# EAGLE design LWOC PCB 2v1 (EAGLE 9.6.2)

## Sheet 1 of 4: POWER + HARDWARE
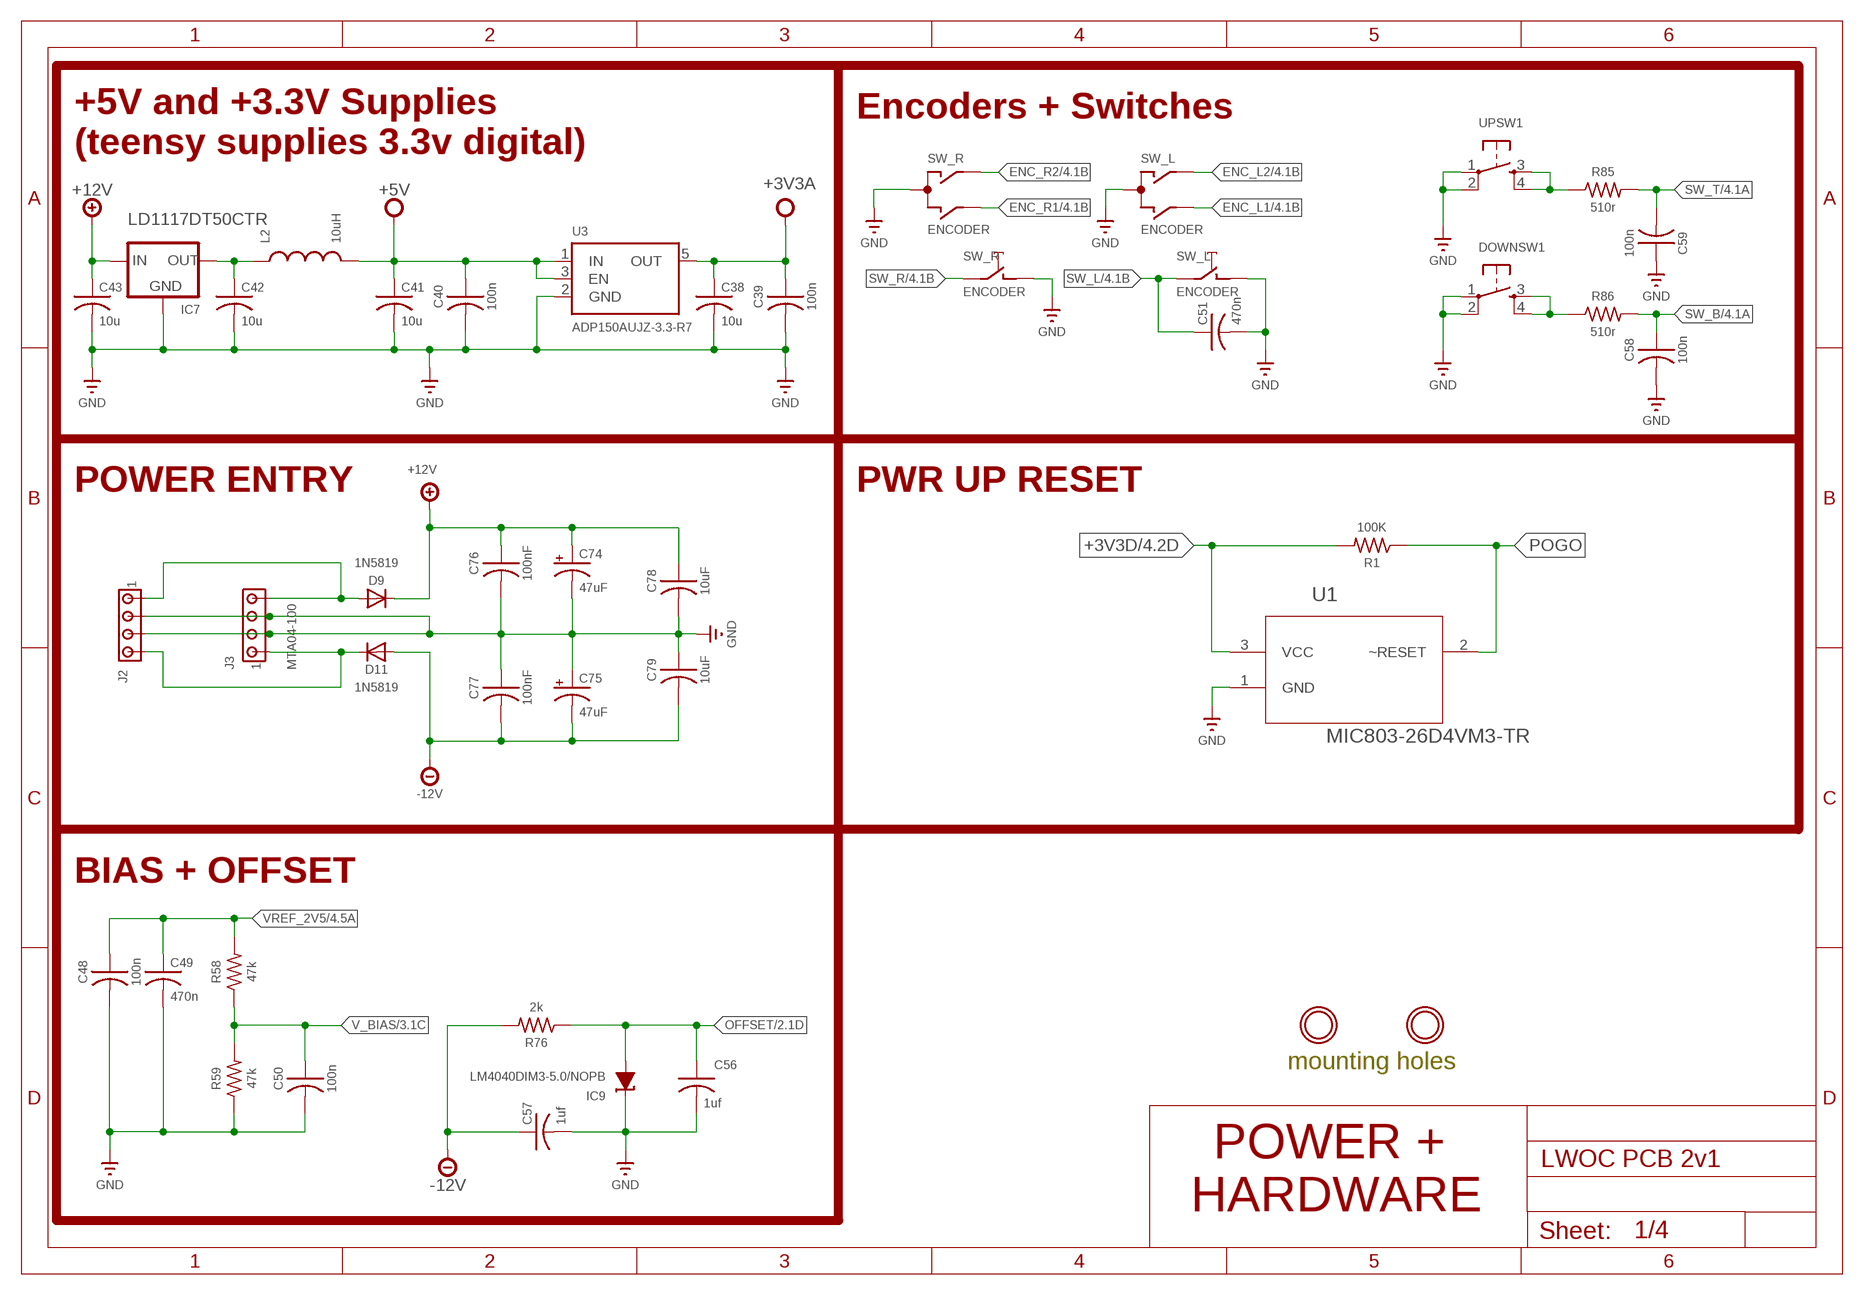
[diagram p0: schematic, sheet 1]

### Parts
C38  10u  C-USC1206K  [C1206K]
C39  100n  RCL_C-USC0603K  [RCL_C0603K]
C40  100n  RCL_C-USC0603K  [RCL_C0603K]
C41  10u  C-USC1206K  [C1206K]
C42  10u  C-USC1206K  [C1206K]
C43  10u  C-USC1206K  [C1206K]
C48  100n  RCL_C-USC0603K  [RCL_C0603K]
C49  470n  RCL_C-USC0603K  [RCL_C0603K]
C50  100n  RCL_C-USC0603K  [RCL_C0603K]
C51  470n  C-USC0805K  [C0805K]
C56  1uf  C-USC0805K  [C0805K]
C57  1uf  C-USC0805K  [C0805K]
C58  100n  RCL_C-USC0603K  [RCL_C0603K]
C59  100n  RCL_C-USC0603K  [RCL_C0603K]
C74  47uF  RCL_CPOL-USE2.5-6  [RCL_E2,5-6]
C75  47uF  RCL_CPOL-USE2.5-6  [RCL_E2,5-6]
C76  100nF  RCL_C-USC0603K  [RCL_C0603K]
C77  100nF  RCL_C-USC0603K  [RCL_C0603K]
C78  10uF  RCL_C-USC1210  [RCL_C1210]
C79  10uF  RCL_C-USC1210  [RCL_C1210]
D9  1N5819  DIODE_DIODE-SOD323-W  [DIODE_SOD323-W]
D11  1N5819  DIODE_DIODE-SOD323-W  [DIODE_SOD323-W]
DOWNSW1  SPARKFUN_TAC_SWITCHPTH  [SPARKFUN_TACTILE-PTH]
IC7  LD1117DT50CTR  LM1117TO252  [TO252]
IC9  LM4040DIM3-5.0/NOPB  LM4041A12DBZ  [DBZ_R-PDSO-G3]
J2  MTA04-156  [1X4MTA]
J3  MTA04-100  [1X04MTA]
L2  10uH  INDUCTOR1210  [1210]
R1  100K  RCL_R-US_R0603  [RCL_R0603]
R58  47k  RCL_R-US_R0603  [RCL_R0603]
R59  47k  RCL_R-US_R0603  [RCL_R0603]
R76  2k  RCL_R-US_R0603  [RCL_R0603]
R85  510r  RCL_R-US_R0603  [RCL_R0603]
R86  510r  RCL_R-US_R0603  [RCL_R0603]
SW_L  ENCODER  OG-ENCODER_EC12E_SW  [OG-ENCODER_ALPS_EC12E_SW]
SW_R  ENCODER  OG-ENCODER_EC12E_SW  [OG-ENCODER_ALPS_EC12E_SW]
U1  MIC803-26D4VM3-TR  MIC803-30D4VM3TR  [SOT95P232X110-3N]
U3  ADP150AUJZ-3.3-R7  ADP121  [SOT23-5]
U$23  MOUNTINGHOLE2.5  [MOUNTINGHOLE_2.5_PLATED]
U$26  MOUNTINGHOLE2.5  [MOUNTINGHOLE_2.5_PLATED]
UPSW1  SPARKFUN_TAC_SWITCHPTH  [SPARKFUN_TACTILE-PTH]

### Nets
+3V3A: C38.1 C39.1 U3.5(OUT) ; also sheet 2,4
+3V3D: R1.2 U1.3(VCC) ; also sheet 4
+5V: C40.1 C41.1 L2.2 U3.1(IN) U3.3(EN) ; also sheet 4
+12V: C43.1 C74.+ C76.1 C78.1 D9.C IC7.2(IN) ; also sheet 3
-12V: C57.1 C75.- C77.2 C79.2 D11.A R76.2 ; also sheet 3
ENC_L1: SW_L.B ; also sheet 4
ENC_L2: SW_L.A ; also sheet 4
ENC_R1: SW_R.B ; also sheet 4
ENC_R2: SW_R.A ; also sheet 4
GND: C38.2 C39.2 C40.2 C41.2 C42.2 C43.2 C48.2 C49.2 C50.2 C51.2 C56.2 C57.2 C58.2 C59.1 C74.- C75.+ C76.2 C77.1 C78.2 C79.1 DOWNSW1.1 DOWNSW1.2 IC7.1(GND) IC9.1(C) J2.2 J2.3 J3.2 J3.3 R59.1 SW_L.C SW_L.D SW_R.C SW_R.D U1.1(GND) U3.2(GND) UPSW1.1 UPSW1.2 ; also sheet 2,3,4
N$33: C42.1 IC7.3(OUT) L2.1
N$40: R85.1 UPSW1.3 UPSW1.4
N$41: DOWNSW1.3 DOWNSW1.4 R86.1
N$196: D11.C J2.4 J3.4
N$263: D9.A J2.1 J3.1
OFFSET: C56.1 IC9.2(A) R76.1 ; also sheet 2
POGO: R1.1 U1.2(~RESET)
SW_B: C58.1 R86.2 ; also sheet 4
SW_L: C51.1 SW_L.E ; also sheet 4
SW_R: SW_R.E ; also sheet 4
SW_T: C59.2 R85.2 ; also sheet 4
V_BIAS: C50.1 R58.1 R59.2 ; also sheet 3
VREF_2V5: C48.1 C49.1 R58.2 ; also sheet 4
Unconnected: SW_L.GND1(G) SW_L.GND2(G) SW_R.GND1(G) SW_R.GND2(G)

### Notes on the sheet
- Encoders + Switches
- +5V and +3.3V Supplies
  (teensy supplies 3.3v digital)
- POWER ENTRY | PWR UP RESET
- BIAS + OFFSET
- mounting holes
- POWER + 
  HARDWARE

## Sheet 2 of 4: INPUT STAGES
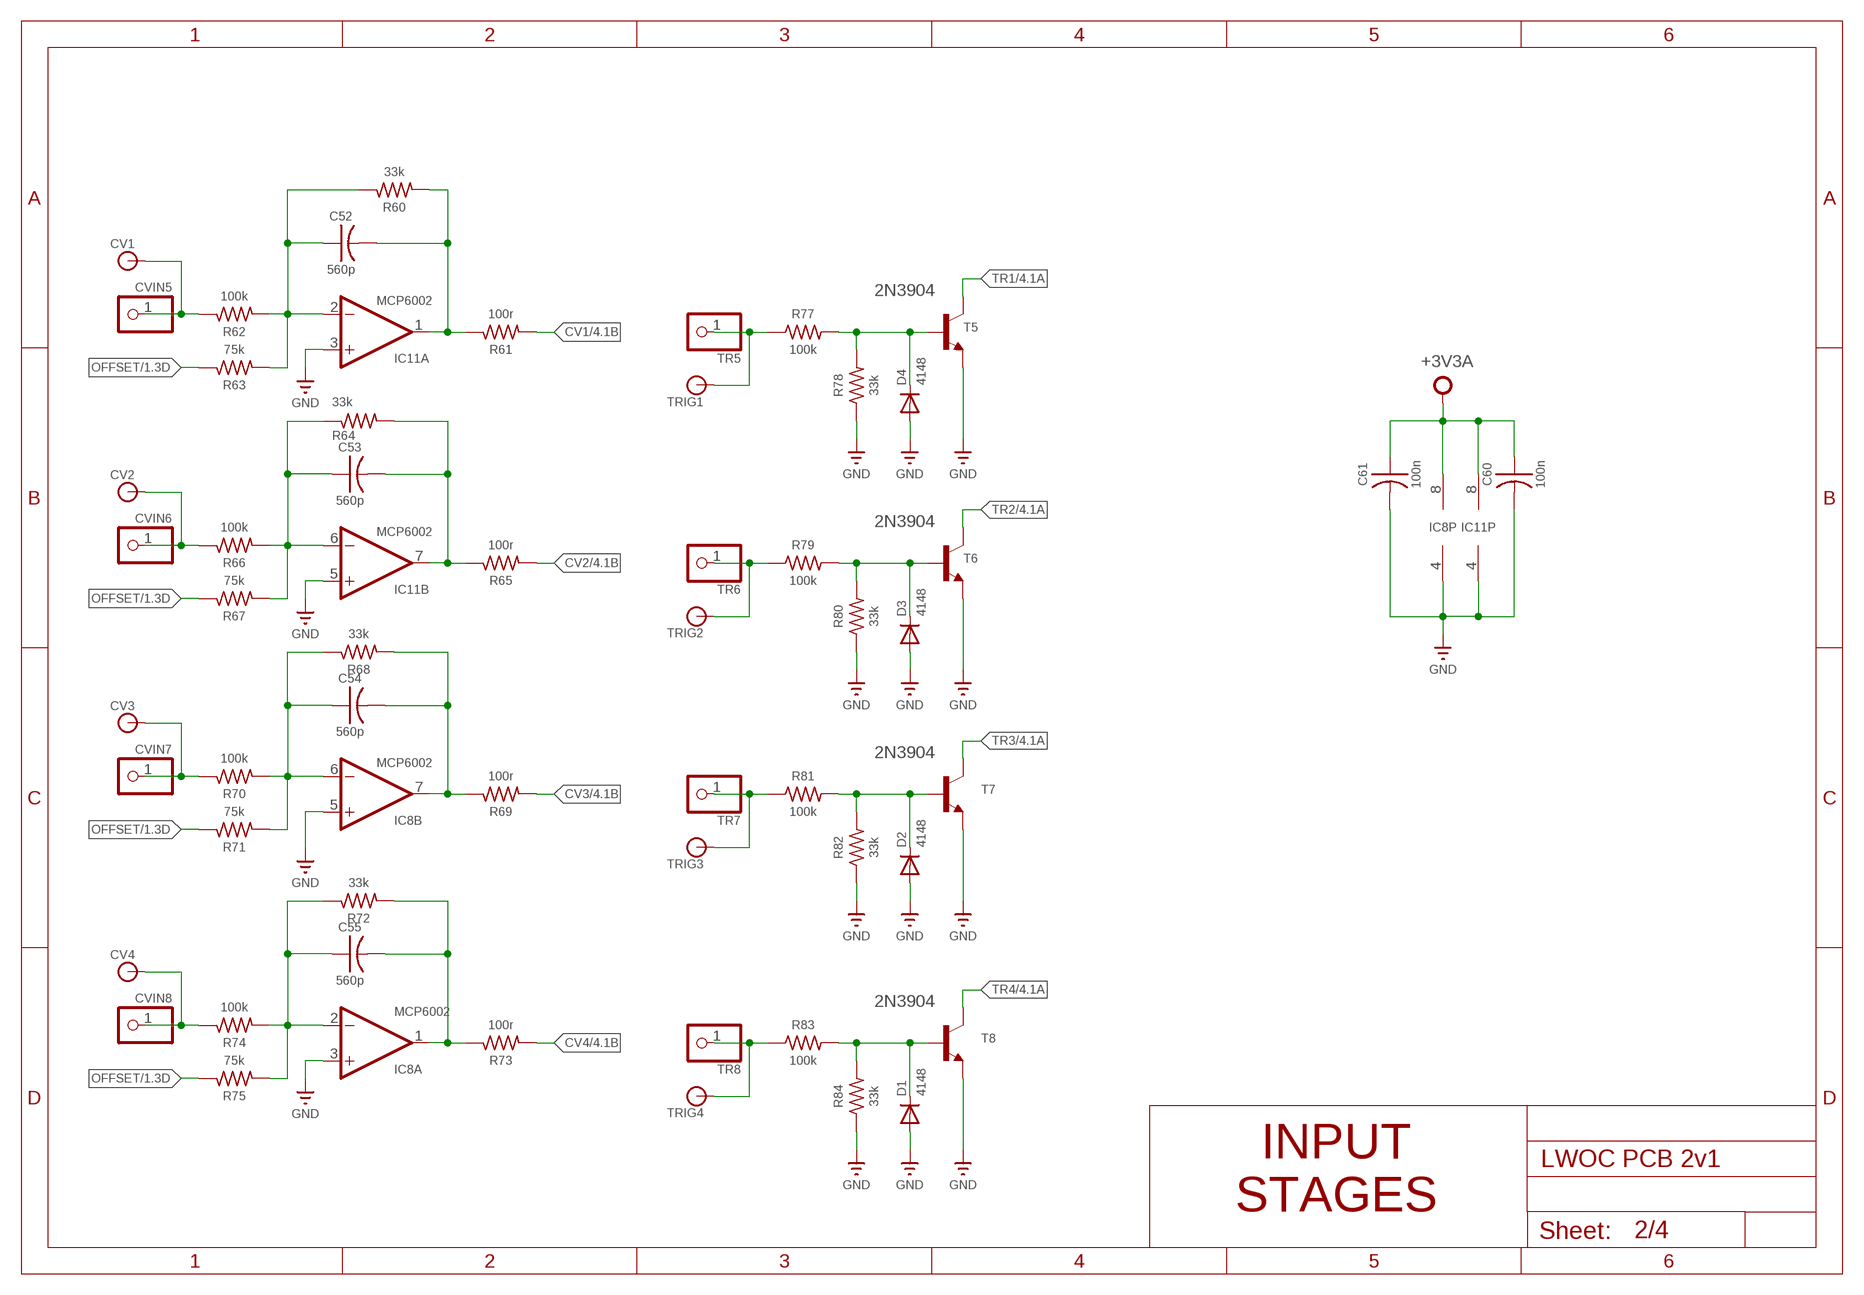
[diagram p1: schematic, sheet 2]

### Parts
C52  560p  RCL_C-USC0603K  [RCL_C0603K]
C53  560p  RCL_C-USC0603K  [RCL_C0603K]
C54  560p  RCL_C-USC0603K  [RCL_C0603K]
C55  560p  RCL_C-USC0603K  [RCL_C0603K]
C60  100n  RCL_C-USC0603K  [RCL_C0603K]
C61  100n  RCL_C-USC0603K  [RCL_C0603K]
CV1  BANANA_CONN  [BANANA_CONN]
CV2  BANANA_CONN  [BANANA_CONN]
CV3  BANANA_CONN  [BANANA_CONN]
CV4  BANANA_CONN  [BANANA_CONN]
CVIN5  PINHD-1X1  [1X01]
CVIN6  PINHD-1X1  [1X01]
CVIN7  PINHD-1X1  [1X01]
CVIN8  PINHD-1X1  [1X01]
D1  4148  DIODE_DIODE-SOD323-W  [DIODE_SOD323-W]
D2  4148  DIODE_DIODE-SOD323-W  [DIODE_SOD323-W]
D3  4148  DIODE_DIODE-SOD323-W  [DIODE_SOD323-W]
D4  4148  DIODE_DIODE-SOD323-W  [DIODE_SOD323-W]
IC8  MCP6002  GM-ICS_TL072D  [GM-ICS_SO08]
IC11  MCP6002  GM-ICS_TL072D  [GM-ICS_SO08]
R60  33k  RCL_R-US_R0603  [RCL_R0603]
R61  100r  RCL_R-US_R0603  [RCL_R0603]
R62  100k  RCL_R-US_R0603  [RCL_R0603]
R63  75k  RCL_R-US_R0603  [RCL_R0603]
R64  33k  RCL_R-US_R0603  [RCL_R0603]
R65  100r  RCL_R-US_R0603  [RCL_R0603]
R66  100k  RCL_R-US_R0603  [RCL_R0603]
R67  75k  RCL_R-US_R0603  [RCL_R0603]
R68  33k  RCL_R-US_R0603  [RCL_R0603]
R69  100r  RCL_R-US_R0603  [RCL_R0603]
R70  100k  RCL_R-US_R0603  [RCL_R0603]
R71  75k  RCL_R-US_R0603  [RCL_R0603]
R72  33k  RCL_R-US_R0603  [RCL_R0603]
R73  100r  RCL_R-US_R0603  [RCL_R0603]
R74  100k  RCL_R-US_R0603  [RCL_R0603]
R75  75k  RCL_R-US_R0603  [RCL_R0603]
R77  100k  RCL_R-US_R0603  [RCL_R0603]
R78  33k  RCL_R-US_R0603  [RCL_R0603]
R79  100k  RCL_R-US_R0603  [RCL_R0603]
R80  33k  RCL_R-US_R0603  [RCL_R0603]
R81  100k  RCL_R-US_R0603  [RCL_R0603]
R82  33k  RCL_R-US_R0603  [RCL_R0603]
R83  100k  RCL_R-US_R0603  [RCL_R0603]
R84  33k  RCL_R-US_R0603  [RCL_R0603]
T5  2N3904  TRANSISTOR_MMBT3904LT1-NPN-SOT23-BEC  [TRANSISTOR_SOT23-BEC]
T6  2N3904  TRANSISTOR_MMBT3904LT1-NPN-SOT23-BEC  [TRANSISTOR_SOT23-BEC]
T7  2N3904  TRANSISTOR_MMBT3904LT1-NPN-SOT23-BEC  [TRANSISTOR_SOT23-BEC]
T8  2N3904  TRANSISTOR_MMBT3904LT1-NPN-SOT23-BEC  [TRANSISTOR_SOT23-BEC]
TR5  PINHD-1X1  [1X01]
TR6  PINHD-1X1  [1X01]
TR7  PINHD-1X1  [1X01]
TR8  PINHD-1X1  [1X01]
TRIG1  BANANA_CONN  [BANANA_CONN]
TRIG2  BANANA_CONN  [BANANA_CONN]
TRIG3  BANANA_CONN  [BANANA_CONN]
TRIG4  BANANA_CONN  [BANANA_CONN]

### Nets
+3V3A: C60.1 C61.1 IC8.8(P:V+) IC11.8(P:V+) ; also sheet 1,4
CV1: R61.2 ; also sheet 4
CV2: R65.2 ; also sheet 4
CV3: R69.2 ; also sheet 4
CV4: R73.2 ; also sheet 4
GND: C60.2 C61.2 D1.A D2.A D3.A D4.A IC8.3(A:+IN) IC8.4(P:V-) IC8.5(B:+IN) IC11.3(A:+IN) IC11.4(P:V-) IC11.5(B:+IN) R78.1 R80.1 R82.1 R84.1 T5.E T6.E T7.E T8.E ; also sheet 1,3,4
N$42: CV1.P$1 CVIN5.1 R62.1
N$43: C52.1 IC11.2(A:-IN) R60.1 R62.2 R63.2
N$44: C52.2 IC11.1(A:OUT) R60.2 R61.1
N$45: CV2.P$1 CVIN6.1 R66.1
N$46: C53.1 IC11.6(B:-IN) R64.1 R66.2 R67.2
N$47: C53.2 IC11.7(B:OUT) R64.2 R65.1
N$48: CV3.P$1 CVIN7.1 R70.1
N$49: C54.1 IC8.6(B:-IN) R68.1 R70.2 R71.2
N$50: C54.2 IC8.7(B:OUT) R68.2 R69.1
N$51: CV4.P$1 CVIN8.1 R74.1
N$52: C55.1 IC8.2(A:-IN) R72.1 R74.2 R75.2
N$53: C55.2 IC8.1(A:OUT) R72.2 R73.1
N$54: R77.1 TR5.1 TRIG1.P$1
N$55: R79.1 TR6.1 TRIG2.P$1
N$56: R81.1 TR7.1 TRIG3.P$1
N$57: D1.C R83.2 R84.2 T8.B
N$58: D2.C R81.2 R82.2 T7.B
N$59: D3.C R79.2 R80.2 T6.B
N$60: D4.C R77.2 R78.2 T5.B
N$61: R83.1 TR8.1 TRIG4.P$1
OFFSET: R63.1 R67.1 R71.1 R75.1 ; also sheet 1
TR1: T5.C ; also sheet 4
TR2: T6.C ; also sheet 4
TR3: T7.C ; also sheet 4
TR4: T8.C ; also sheet 4

### Notes on the sheet
- INPUT
  STAGES

## Sheet 3 of 4: OUTPUT STAGES
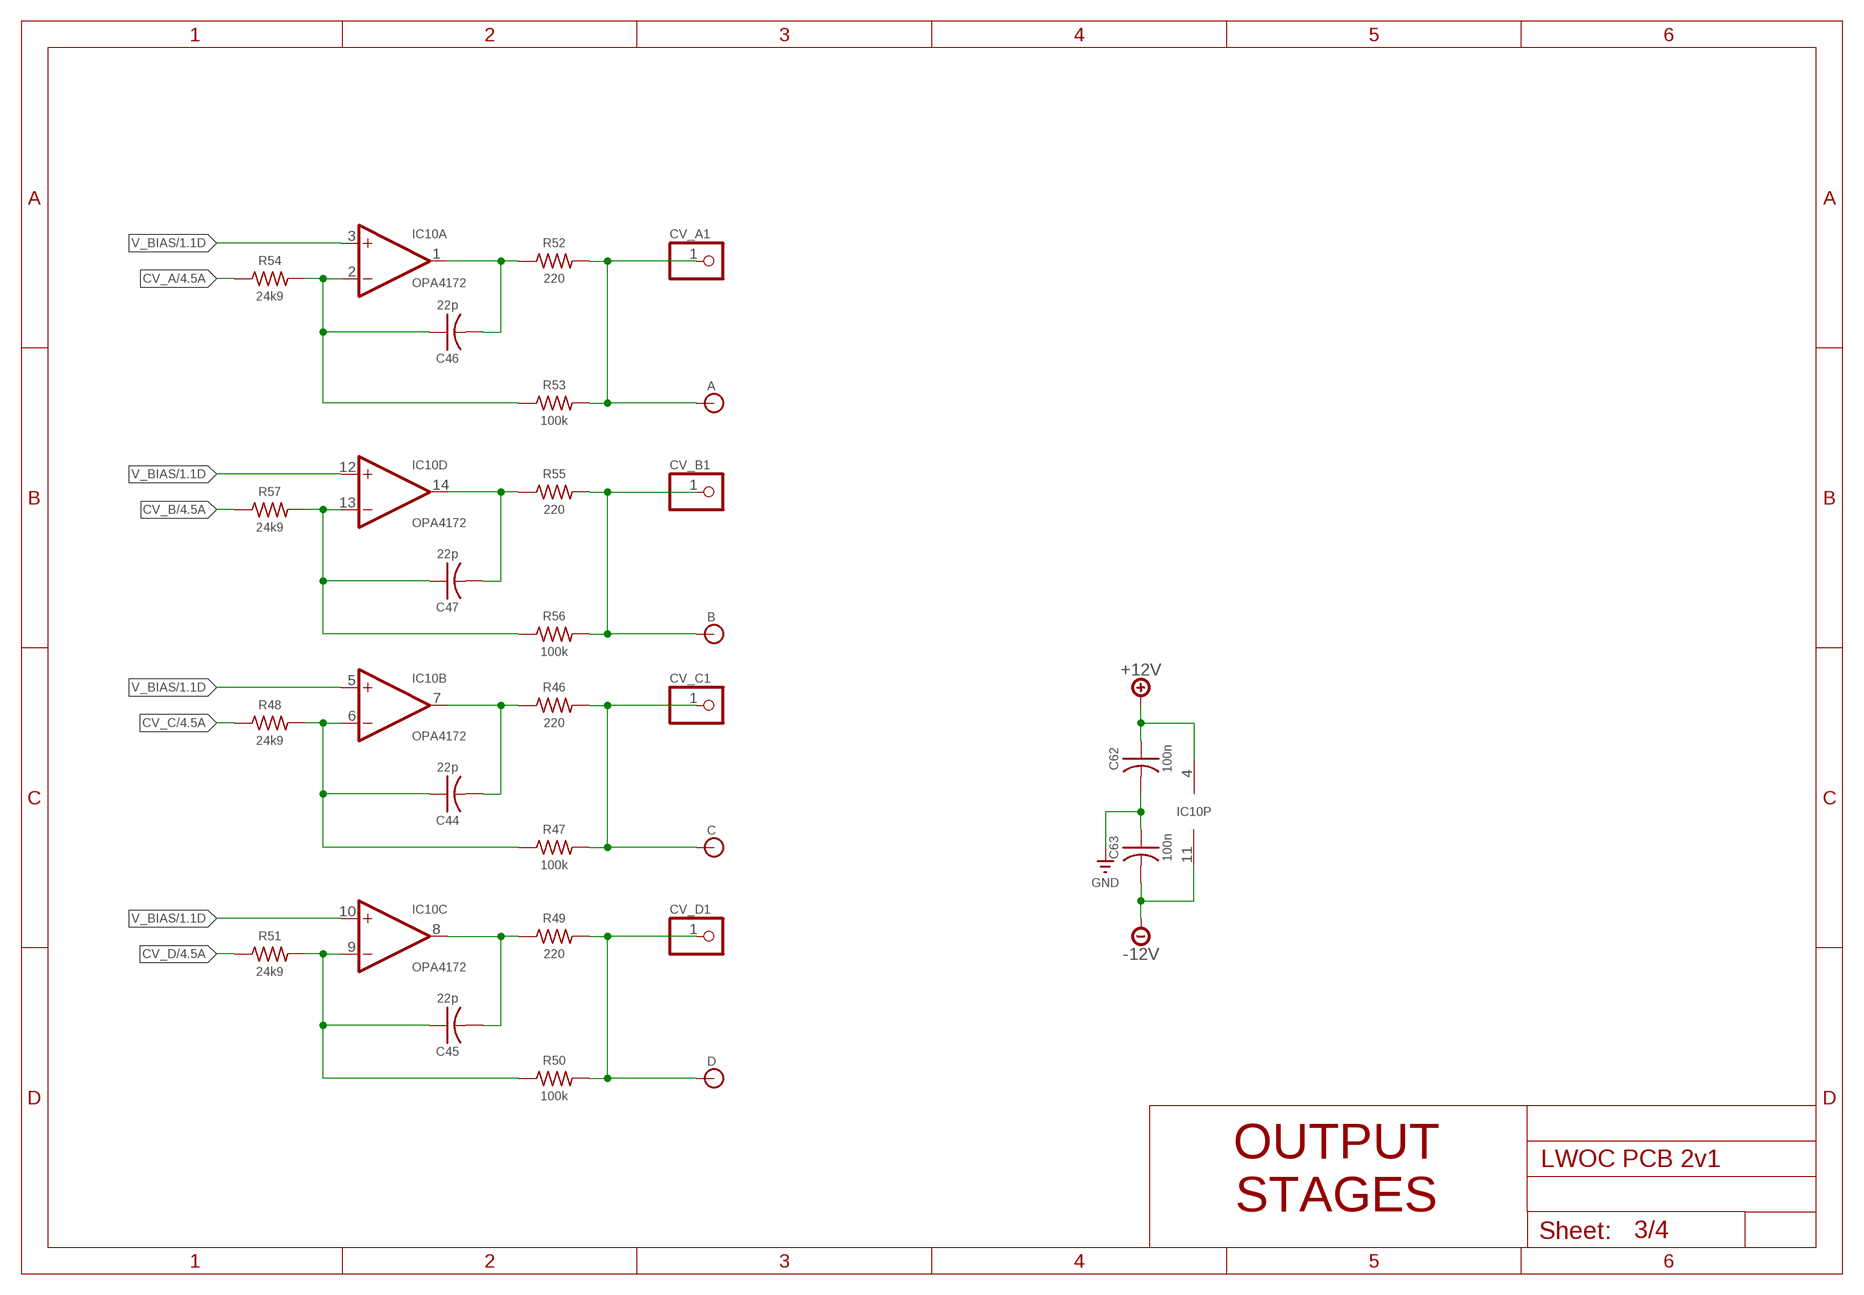
[diagram p2: schematic, sheet 3]

### Parts
A  BANANA_CONN  [BANANA_CONN]
B  BANANA_CONN  [BANANA_CONN]
C  BANANA_CONN  [BANANA_CONN]
C44  22p  RCL_C-USC0603K  [RCL_C0603K]
C45  22p  RCL_C-USC0603K  [RCL_C0603K]
C46  22p  RCL_C-USC0603K  [RCL_C0603K]
C47  22p  RCL_C-USC0603K  [RCL_C0603K]
C62  100n  RCL_C-USC0603K  [RCL_C0603K]
C63  100n  RCL_C-USC0603K  [RCL_C0603K]
CV_A1  PINHD-1X1  [1X01]
CV_B1  PINHD-1X1  [1X01]
CV_C1  PINHD-1X1  [1X01]
CV_D1  PINHD-1X1  [1X01]
D  BANANA_CONN  [BANANA_CONN]
IC10  OPA4172  GM-ICS_TL074D  [GM-ICS_SO14]
R46  220  RCL_R-US_R0603  [RCL_R0603]
R47  100k  RCL_R-US_R0603  [RCL_R0603]
R48  24k9  RCL_R-US_R0603  [RCL_R0603]
R49  220  RCL_R-US_R0603  [RCL_R0603]
R50  100k  RCL_R-US_R0603  [RCL_R0603]
R51  24k9  RCL_R-US_R0603  [RCL_R0603]
R52  220  RCL_R-US_R0603  [RCL_R0603]
R53  100k  RCL_R-US_R0603  [RCL_R0603]
R54  24k9  RCL_R-US_R0603  [RCL_R0603]
R55  220  RCL_R-US_R0603  [RCL_R0603]
R56  100k  RCL_R-US_R0603  [RCL_R0603]
R57  24k9  RCL_R-US_R0603  [RCL_R0603]

### Nets
+12V: C62.1 IC10.4(P:V+) ; also sheet 1
-12V: C63.2 IC10.11(P:V-) ; also sheet 1
CV_A: R54.1 ; also sheet 4
CV_B: R57.1 ; also sheet 4
CV_C: R48.1 ; also sheet 4
CV_D: R51.1 ; also sheet 4
GND: C62.2 C63.1 ; also sheet 1,2,4
N$62: C44.1 IC10.6(B:-IN) R47.1 R48.2
N$63: C44.2 IC10.7(B:OUT) R46.1
N$64: C45.1 IC10.9(C:-IN) R50.1 R51.2
N$65: C45.2 IC10.8(C:OUT) R49.1
N$66: C46.1 IC10.2(A:-IN) R53.1 R54.2
N$67: C46.2 IC10.1(A:OUT) R52.1
N$68: C47.1 IC10.13(D:-IN) R56.1 R57.2
N$69: C47.2 IC10.14(D:OUT) R55.1
N$70: B.P$1 CV_B1.1 R55.2 R56.2
N$71: CV_D1.1 D.P$1 R49.2 R50.2
N$72: A.P$1 CV_A1.1 R52.2 R53.2
N$73: C.P$1 CV_C1.1 R46.2 R47.2
V_BIAS: IC10.3(A:+IN) IC10.5(B:+IN) IC10.10(C:+IN) IC10.12(D:+IN) ; also sheet 1

### Notes on the sheet
- OUTPUT
  STAGES

## Sheet 4 of 4: TEENSY DAC and OLED
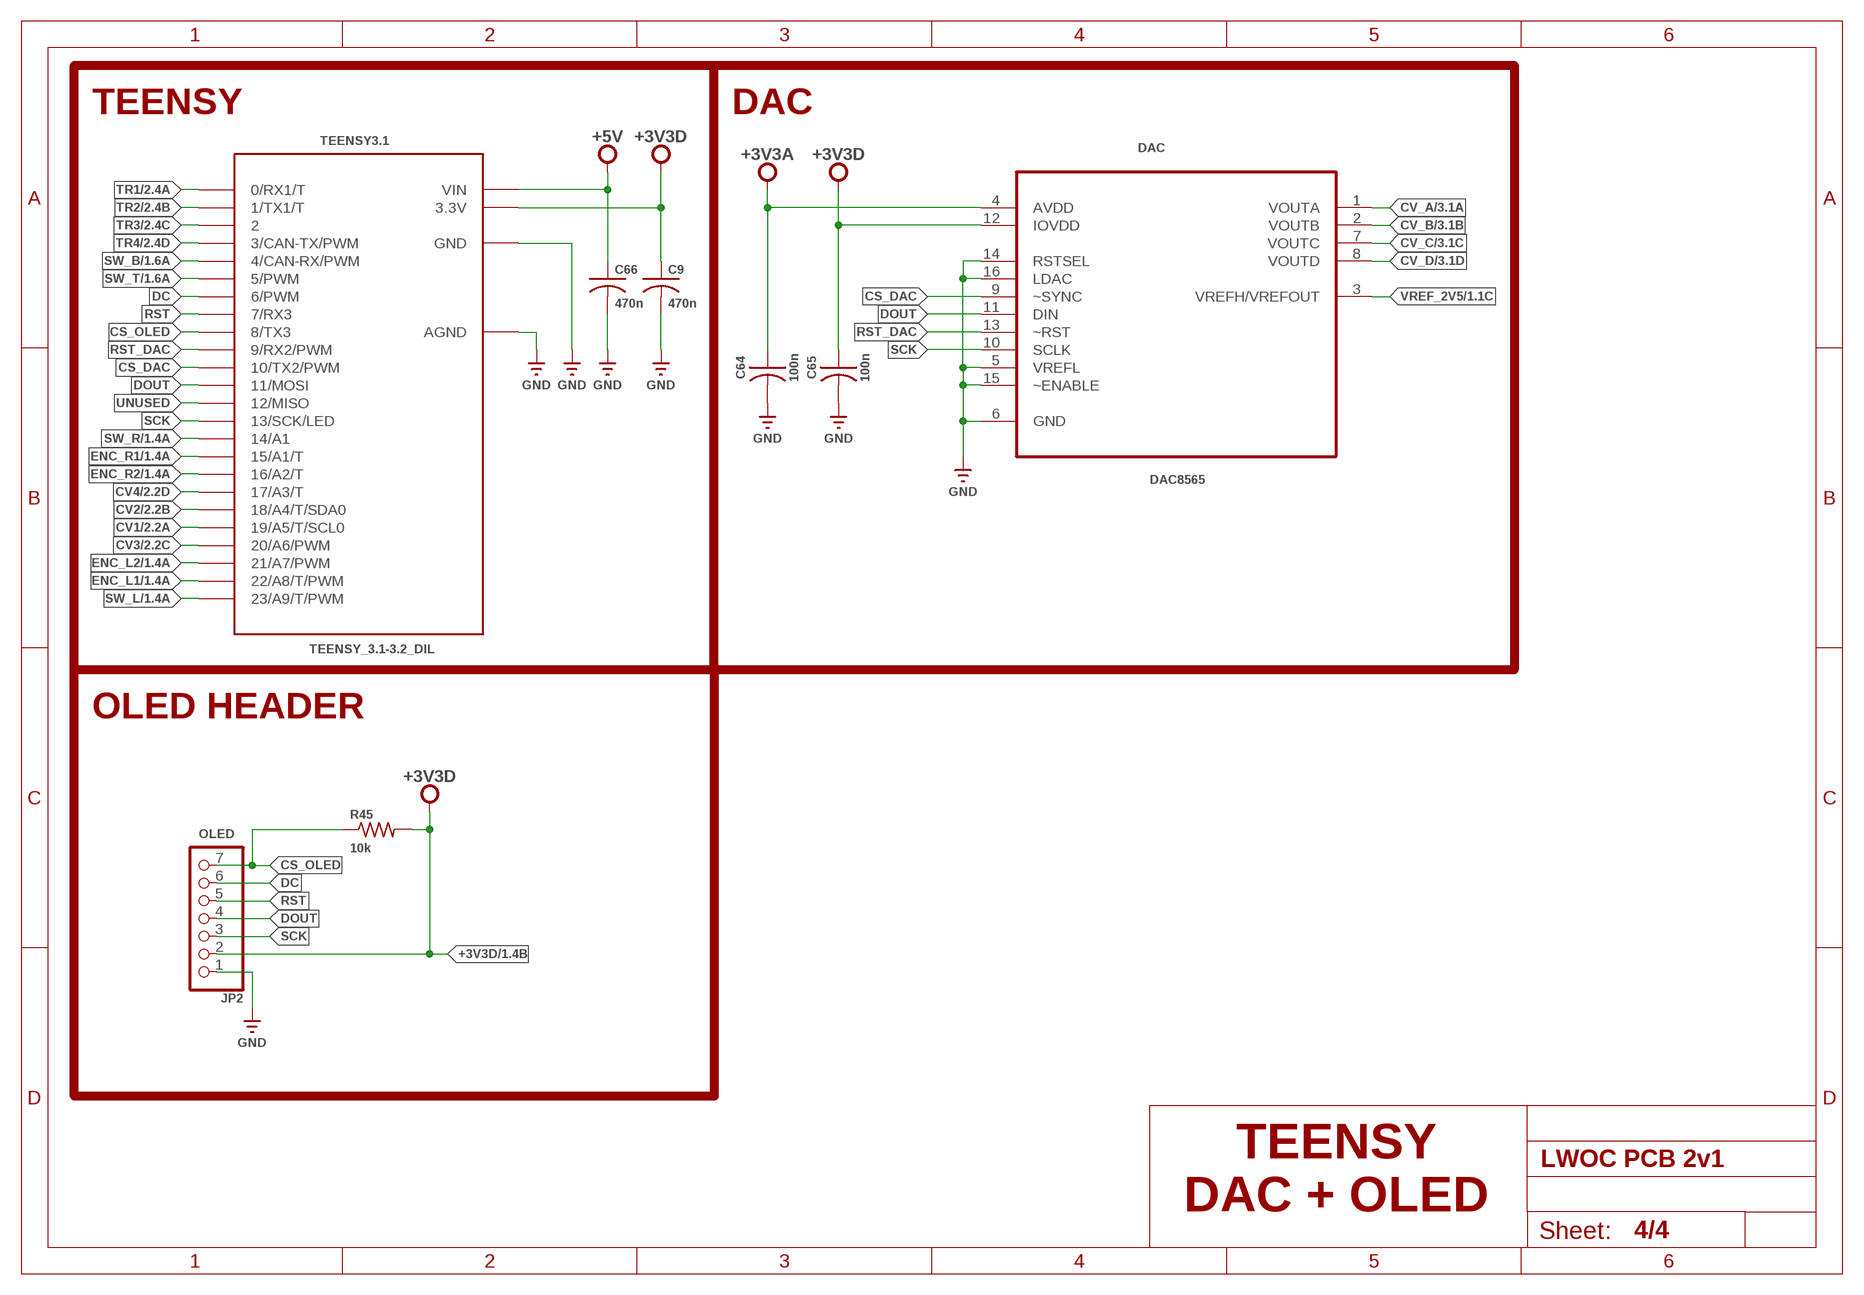
[diagram p3: schematic, sheet 4]

### Parts
C9  470n  C-USC0805K  [C0805K]
C64  100n  RCL_C-USC0603K  [RCL_C0603K]
C65  100n  RCL_C-USC0603K  [RCL_C0603K]
C66  470n  C-USC0805K  [C0805K]
DAC  DAC8565  DAC8565IAPW  [SOP65P640X120-16N]
JP2  OLED  PINHD-1X07_2.54-S  [1X07-S]
R45  10k  R-US_M0805  [M0805]
TEENSY3.1  TEENSY_3.1-3.2_DIL  [TEENSY_3.0-3.2&LC_DIL]

### Nets
+3V3A: C64.1 DAC.4(AVDD) ; also sheet 1,2
+3V3D: C9.1 C65.1 DAC.12(IOVDD) JP2.2 R45.2 TEENSY3.1.3.3V ; also sheet 1
+5V: C66.1 TEENSY3.1.VIN ; also sheet 1
CS_DAC: DAC.9(~SYNC) TEENSY3.1.10(10/TX2/PWM)
CS_OLED: JP2.7 R45.1 TEENSY3.1.8(8/TX3)
CV1: TEENSY3.1.19/A5(19/A5/T/SCL0) ; also sheet 2
CV2: TEENSY3.1.18/A4(18/A4/T/SDA0) ; also sheet 2
CV3: TEENSY3.1.20/A6(20/A6/PWM) ; also sheet 2
CV4: TEENSY3.1.17/A3(17/A3/T) ; also sheet 2
CV_A: DAC.1(VOUTA) ; also sheet 3
CV_B: DAC.2(VOUTB) ; also sheet 3
CV_C: DAC.7(VOUTC) ; also sheet 3
CV_D: DAC.8(VOUTD) ; also sheet 3
DC: JP2.6 TEENSY3.1.6(6/PWM)
DOUT: DAC.11(DIN) JP2.4 TEENSY3.1.11(11/MOSI)
ENC_L1: TEENSY3.1.22/A8(22/A8/T/PWM) ; also sheet 1
ENC_L2: TEENSY3.1.21/A7(21/A7/PWM) ; also sheet 1
ENC_R1: TEENSY3.1.15/A1(15/A1/T) ; also sheet 1
ENC_R2: TEENSY3.1.16/A2(16/A2/T) ; also sheet 1
GND: C9.2 C64.2 C65.2 C66.2 DAC.5(VREFL) DAC.6(GND) DAC.14(RSTSEL) DAC.15(~ENABLE) DAC.16(LDAC) JP2.1 TEENSY3.1.AGND TEENSY3.1.GND ; also sheet 1,2,3
RST: JP2.5 TEENSY3.1.7(7/RX3)
RST_DAC: DAC.13(~RST) TEENSY3.1.9(9/RX2/PWM)
SCK: DAC.10(SCLK) JP2.3 TEENSY3.1.13(13/SCK/LED)
SW_B: TEENSY3.1.4(4/CAN-RX/PWM) ; also sheet 1
SW_L: TEENSY3.1.23/A9(23/A9/T/PWM) ; also sheet 1
SW_R: TEENSY3.1.14/A0(14/A1) ; also sheet 1
SW_T: TEENSY3.1.5(5/PWM) ; also sheet 1
TR1: TEENSY3.1.0(0/RX1/T) ; also sheet 2
TR2: TEENSY3.1.1(1/TX1/T) ; also sheet 2
TR3: TEENSY3.1.2 ; also sheet 2
TR4: TEENSY3.1.3(3/CAN-TX/PWM) ; also sheet 2
UNUSED: TEENSY3.1.12(12/MISO)
VREF_2V5: DAC.3(VREFH/VREFOUT) ; also sheet 1

### Notes on the sheet
- TEENSY | DAC
- OLED HEADER
- TEENSY
  DAC + OLED

## Library data of the parts
A B C CV1-CV4 D TRIG1-TRIG4 = SparkFun-Connectors:BANANA_CONN: Through-hole Banana Jack Basic PTH connection for banana jack plugs SparkFun Products: Multimeter Kit <https://www.sparkfun.com/products/retired/10956> Banana to Alligator Cable <https://www.sparkfun.com/products/retired/509> Banana to Alligator Coax Cable <https://www.sparkfun.com/products/retired/508> Banana to Banana Cable <https://www.sparkfun.com/products/retired/507> Banana to IC Hook Cables <https://www.sparkfun.com/products/retired/506>
C9 C38 C41-C43 C51 C56 C57 C66 = elements_v02:C-US: CAPACITOR, American symbol
C39 C40 C44-C50 C52-C55 C58-C65 C78 C79 = clouds_v30:RCL_C-US: CAPACITOR, American symbol
C74 C75 = ripples_v40:RCL_CPOL-US: POLARIZED CAPACITOR, American symbol
C76 C77 = ripples_v40:RCL_C-US: CAPACITOR, American symbol
CV_A1 CV_B1 CV_C1 CV_D1 CVIN5-CVIN8 TR5-TR8 = pinhead:PINHD-1X1: PIN HEADER
D1-D4 = clouds_v30:DIODE_DIODE-: DIODE
D9 D11 = ripples_v40:DIODE_DIODE-: DIODE
DAC = DAC8565IAPW:DAC8565IAPW: Quad Channel DAC; AVAILABILITY: Good; DESCRIPTION: 16-Bit, Quad Channel, Ultra-Low Glitch, Voltage Output DAC with 2.5V, 2ppm/C Internal eference 16-TSSOP -40 to 105; MF: Texas Instruments; MP: DAC8565IAPW; PACKAGE: TSSOP-16 Texas Instruments; PRICE: 11.99 USD
DOWNSW1 UPSW1 = clouds_v30:SPARKFUN_TAC_SWITCH: Momentary Switch Button commonly used for reset or general input. Spark Fun Electronics SKU : COM-00097
IC7 = v-reg-2:LM1117
IC8 IC11 = clouds_v30:GM-ICS_TL072: OP AMP
IC9 = elements_v02:LM4041: PRECISION MICROPOWER SHUNT VOLTAGE REFERENCE Source: http://focus.ti.com/lit/ds/slcs146e/slcs146e.pdf
IC10 = clouds_v30:GM-ICS_TL074: OP AMP
J2 = con-amp:MTA04-156: AMP connector
J3 = AMP_MTA:MTA04-100
JP2 = pinhead-2:PINHD-1X07: PIN HEADER
L2 = Icotech_Eagle_Library:INDUCTOR: Inductors Basic Inductor/Choke - 0603 and 1206. Footprints are not proven and vary greatly between part numbers.
R1 R46-R86 = clouds_v30:RCL_R-US_: RESISTOR, American symbol
R45 = elements_v02:R-US_: RESISTOR, American symbol
SW_L SW_R = braids_v50:OG-ENCODER_EC12E_SW: ALPS rotary Encoder EC12E series with switch
T5-T8 = braids_v50:TRANSISTOR_*-NPN-: NPN Transistror BF959 corrected 2008.03.06
TEENSY3.1 = Teensy_3_and_LC_Series_Boards_v1.4:TEENSY_3.1-3.2_DIL: Teensy 3.1 or 3.2 in a DIL Layout.
U1 = Micrel_By_element14_Batch_1:MIC803-30D4VM3TR: 3 Pin Microprocessor Supervisor Circuit; MPN: MIC803-30D4VM3TR; OC_FARNELL: 1924769; OC_NEWARK: 58T4951; PACKAGE: SOT-23-3; SUPPLIER: MICREL SEMICONDUCTOR
U3 = microbuilder:ADP121: LDO Fixed Voltage Regulator 150mA The ADP121 voltage regulator is ideal for regulating battery or solar power due to it's very low foreward voltage drop (maximum 90mV at 150mA). Forward Voltage Dropout: 90mV at 150mA Input Voltage Range: 2.3V-5.5V Output Voltage Range: 1.2V-3.3V (depending on model) Digikey: 3.3V - ADP121-AUJZ33R7CT-ND Digikey: 3.0V - ADP121-AUJZ30R7CT-ND
U$23 U$26 = microbuilder:MOUNTINGHOLE: Mounting Hole For #2 screws (0.086"/2.18mm width, 0.094"/2.4mm hole) use 2.5mm

## Board
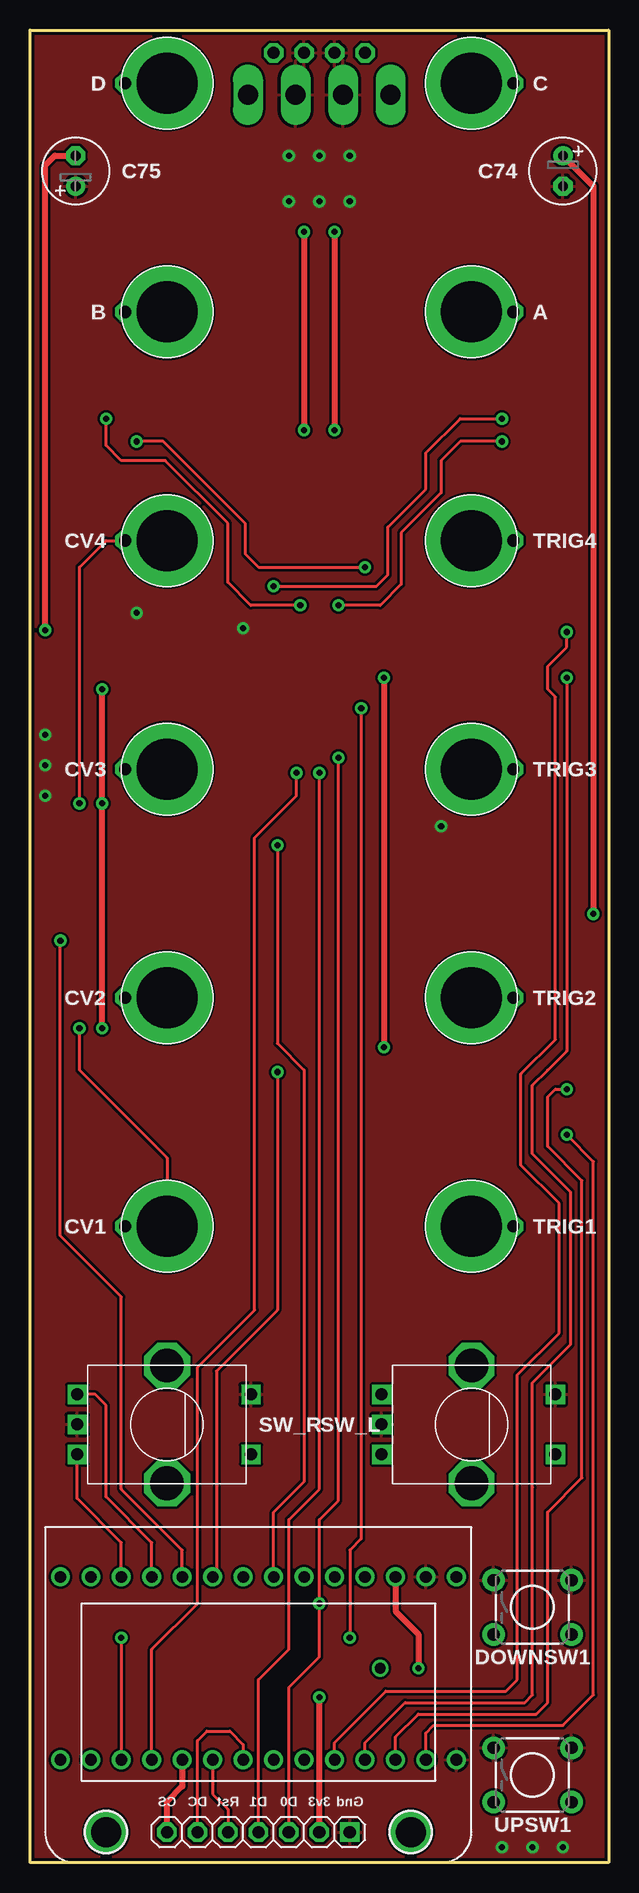
[diagram p4: board, top side]
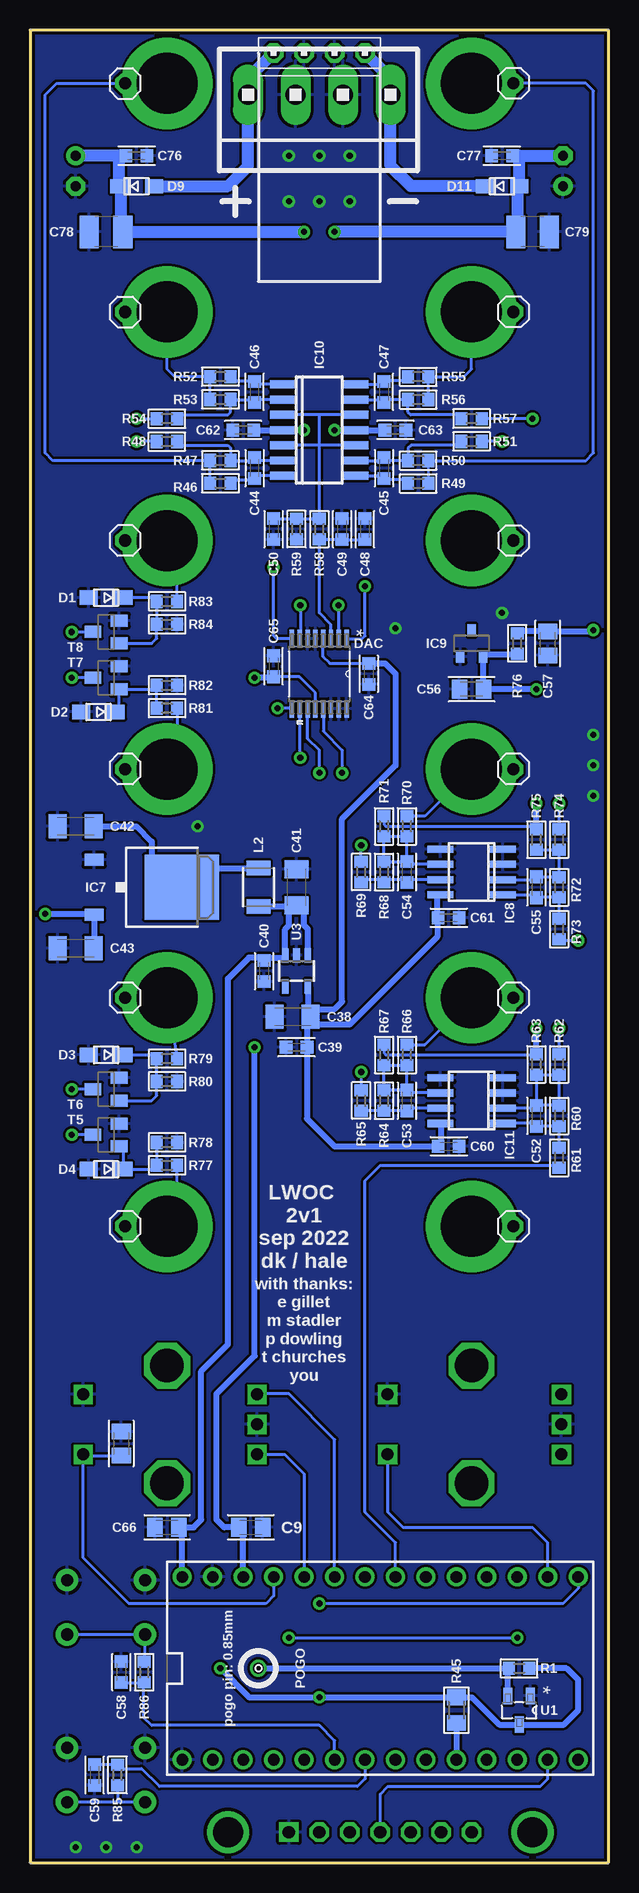
[diagram p5: board, bottom side, seen from below]

Size 48.26 x 152.72 mm. Coordinates in mm from the lower left corner, seen from the top.
Outline: 0,152.72 48.26,152.72 48.26,0 0,0 0,152.72
Copper layers (1*16): Top 0.035mm / dielectric 1.5mm / Bottom 0.035mm
Design rules "SparkFun": minimum track width 8mil, minimum drill 20mil, track to track 8mil, track to pad 8mil, pad to pad 8mil, via to via 8mil, smd to smd 8mil, copper to edge 10mil, drill to drill 8mil, minimum pad ring 12mil, minimum via ring 10mil, stop-mask expansion 4mil, vias tented up to drill 25mil, thermal gap 10mil

### Footprints (pad centres in the part's own frame; a part is rotated, then mirrored left to right if it is on the bottom)
BANANA_CONN = drill 5.08 pad 7.62: P$1 0,0
C0805K = smd 1.3 x 1.6: 1 -1,0; 2 1,0
C1206K = smd 1.5 x 2: 1 -1.5,0; 2 1.5,0
RCL_C0603K = smd 1.05 x 1.08: 1 -0.875,0; 2 0.875,0
RCL_E2,5-6 = drill 0.813 pad 1.6: + -1.27,0 | drill 0.813 pad 1.6 octagon: - 1.27,0
RCL_C1210 = smd 1.6 x 2.7: 1 -1.4,0; 2 1.4,0
1X01 = drill 1.016 octagon: 1 0,0
DIODE_SOD323-W = smd 1.5 x 1.2: A 1.45,0; C -1.45,0
SOP65P640X120-16N = smd 1.473 x 0.356: 1 -2.921,2.286; 2 -2.921,1.626; 3 -2.921,0.965; 4 -2.921,0.33; 5 -2.921,-0.33; 6 -2.921,-0.965; 7 -2.921,-1.626; 8 -2.921,-2.286; 9 2.921,-2.286; 10 2.921,-1.626; 11 2.921,-0.965; 12 2.921,-0.33; 13 2.921,0.33; 14 2.921,0.965; 15 2.921,1.626; 16 2.921,2.286
SPARKFUN_TACTILE-PTH = drill 1.016 pad 1.88: 1 -3.251,2.261; 2 3.251,2.261; 3 -3.251,-2.261; 4 3.251,-2.261
TO252 = smd 1 x 1.6: 1 -2.28,-6.07; 2 2.28,-6.07 | smd 5.4 x 6.2: 3 0,1.23
GM-ICS_SO08 = smd 0.6 x 2.2: 1 -1.905,-2.6; 2 -0.635,-2.6; 3 0.635,-2.6; 4 1.905,-2.6; 5 1.905,2.6; 6 0.635,2.6; 7 -0.635,2.6; 8 -1.905,2.6
DBZ_R-PDSO-G3 = smd 0.7 x 1: 1 -0.95,-1.1; 2 0.95,-1.1; 3 0,1.1
GM-ICS_SO14 = smd 0.66 x 2.032: 1 -3.81,-3.073; 2 -2.54,-3.073; 3 -1.27,-3.073; 4 0,-3.073; 5 1.27,-3.073; 6 2.54,-3.073; 7 3.81,-3.073; 8 3.81,3.073; 9 2.54,3.073; 10 1.27,3.073; 11 0,3.073; 12 -1.27,3.073; 13 -2.54,3.073; 14 -3.81,3.073
1X4MTA = drill 1.676 long: 1 5.944,0; 2 1.981,0; 3 -1.981,0; 4 -5.944,0
1X04MTA = drill 1.016 pad 1.575 octagon: 1 3.81,0; 2 1.27,0; 3 -1.27,0; 4 -3.81,0
1X07-S = drill 1.016 square: 1 -7.62,0 | drill 1.016 octagon: 2 -5.08,0; 3 -2.54,0; 4 0,0; 5 2.54,0; 6 5.08,0; 7 7.62,0
1210 = smd 1.2 x 2: 1 -1.6,0; 2 1.6,0
RCL_R0603 = smd 1 x 1.1: 1 -0.85,0; 2 0.85,0
M0805 = smd 1.3 x 1.6: 1 -1.077,0; 2 1.077,0
OG-ENCODER_ALPS_EC12E_SW = drill 1 square: A -2.5,-7.5; B 2.5,-7.5; C 0,-7.5; D -2.5,7; E 2.5,7 | drill 2.8 octagon: GND1 -4.9,0; GND2 4.9,0
TRANSISTOR_SOT23-BEC = smd 1 x 1.4: B -0.95,-1.1; C 0,1.1; E 0.95,-1.1
TEENSY_3.0-3.2&LC_DIL = drill 0.965: 0 -7.62,13.97; 1 -7.62,11.43; 2 -7.62,8.89; 3 -7.62,6.35; 3.3V 7.62,11.43; 4 -7.62,3.81; 5 -7.62,1.27; 6 -7.62,-1.27; 7 -7.62,-3.81; 8 -7.62,-6.35; 9 -7.62,-8.89; 10 -7.62,-11.43; 11 -7.62,-13.97; 12 -7.62,-16.51; 13 7.62,-16.51; 14/A0 7.62,-13.97; 15/A1 7.62,-11.43; 16/A2 7.62,-8.89; 17/A3 7.62,-6.35; 18/A4 7.62,-3.81; 19/A5 7.62,-1.27; 20/A6 7.62,1.27; 21/A7 7.62,3.81; 22/A8 7.62,6.35; 23/A9 7.62,8.89; AGND 7.62,13.97; GND -7.62,16.51; VIN 7.62,16.51
SOT95P232X110-3N = smd 1.397 x 0.762: 1 -1.194,0.94; 2 -1.194,-0.94; 3 1.194,0
SOT23-5 = smd 0.55 x 1.2: 1 -0.95,-1.3; 2 0,-1.3; 3 0.95,-1.3; 4 0.95,1.3; 5 -0.95,1.3
MOUNTINGHOLE_2.5_PLATED = drill 2.5 pad 3.2: P$1 0,0

### Placement (x,y rotation side)
A  36.83,129.22 180 top
B  11.43,129.22 180 top
C  36.83,148.27 180 top
C9  29.84,27.94 0 bottom
C38  26.35,70.48 180 bottom
C39  26.04,67.95 180 bottom
C40  28.73,74.3 270 bottom
C41  26.04,81.28 90 bottom
C42  44.45,86.36 180 bottom
C43  44.45,76.2 180 bottom
C44  29.53,116.21 270 bottom
C45  18.73,116.21 270 bottom
C46  29.53,122.56 90 bottom
C47  18.73,122.56 90 bottom
C48  20.32,111.12 90 bottom
C49  22.22,111.12 90 bottom
C50  27.94,111.12 270 bottom
C51  40.64,34.93 90 bottom
C52  6.03,62.23 270 bottom
C53  16.83,63.5 270 bottom
C54  16.83,82.55 270 bottom
C55  6.03,81.28 270 bottom
C56  11.43,97.79 180 bottom
C57  5.08,101.6 270 bottom
C58  40.64,15.88 90 bottom
C59  42.86,7.3 90 bottom
C60  13.33,59.69 0 bottom
C61  13.33,78.74 0 bottom
C62  30.48,119.38 180 bottom
C63  17.78,119.38 180 bottom
C64  20,99.06 270 bottom
C65  27.94,99.7 90 bottom
C66  36.83,27.94 180 bottom
C74  44.45,140.97 270 top
C75  3.81,140.97 90 top
C76  39.37,142.24 0 bottom
C77  8.89,142.24 0 bottom
C78  41.91,135.89 180 bottom
C79  6.35,135.89 180 bottom
CV1  11.43,53.02 180 top
CV2  11.43,72.07 180 top
CV3  11.43,91.12 180 top
CV4  11.43,110.17 180 top
CV_A1  40.32,129.22 90 bottom
CV_B1  7.94,129.22 270 bottom
CV_C1  40.32,148.27 90 bottom
CV_D1  7.94,148.27 270 bottom
CVIN5  7.94,53.02 270 bottom
CVIN6  7.94,72.07 270 bottom
CVIN7  7.94,91.12 270 bottom
CVIN8  7.94,110.17 0 bottom
D  11.43,148.27 180 top
D1  41.91,105.41 180 bottom
D2  42.55,95.89 180 bottom
D3  41.91,67.31 180 bottom
D4  41.91,57.79 180 bottom
D9  39.37,139.7 0 bottom
D11  8.89,139.7 0 bottom
DAC  24.13,99.06 270 bottom
DOWNSW1  41.91,21.27 0 top
IC7  36.83,81.28 270 bottom
IC8  11.43,82.55 90 bottom
IC9  11.43,101.6 0 bottom
IC10  24.13,119.38 270 bottom
IC11  11.43,63.5 90 bottom
J2  24.13,147.32 180 bottom
J3  24.13,150.81 180 bottom
JP2  19.05,2.54 180 top
L2  29.21,81.28 270 bottom
R1  7.46,16.19 0 bottom
R45  12.7,12.7 90 bottom
R46  32.38,114.94 180 bottom
R47  32.38,116.84 180 bottom
R48  36.83,118.43 0 bottom
R49  15.87,114.94 0 bottom
R50  15.87,116.84 0 bottom
R51  11.43,118.43 180 bottom
R52  32.38,123.83 180 bottom
R53  32.38,121.92 180 bottom
R54  36.83,120.33 0 bottom
R55  15.87,123.83 0 bottom
R56  15.87,121.92 0 bottom
R57  11.43,120.33 180 bottom
R58  24.13,111.12 270 bottom
R59  26.04,111.12 90 bottom
R60  4.13,62.23 270 bottom
R61  4.13,58.74 270 bottom
R62  4.13,66.52 270 bottom
R63  6.03,66.52 270 bottom
R64  18.73,63.5 270 bottom
R65  20.64,63.5 90 bottom
R66  16.83,67.31 270 bottom
R67  18.73,67.31 270 bottom
R68  18.73,82.55 270 bottom
R69  20.64,82.55 90 bottom
R70  16.83,86.36 270 bottom
R71  18.73,86.36 270 bottom
R72  4.13,81.28 270 bottom
R73  4.13,77.79 270 bottom
R74  4.13,85.25 270 bottom
R75  6.03,85.25 270 bottom
R76  7.62,101.6 90 bottom
R77  36.83,58.1 180 bottom
R78  36.83,60.01 180 bottom
R79  36.83,66.99 180 bottom
R80  36.83,65.09 180 bottom
R81  36.83,96.2 180 bottom
R82  36.83,98.11 180 bottom
R83  36.83,105.09 180 bottom
R84  36.83,103.19 180 bottom
R85  40.96,7.3 90 bottom
R86  38.73,15.88 270 bottom
SW_L  36.83,36.51 270 top
SW_R  11.43,36.51 270 top
T5  41.91,60.64 90 bottom
T6  41.91,64.45 90 bottom
T7  41.91,98.74 90 bottom
T8  41.91,102.55 90 bottom
TEENSY3.1  19.05,16.19 90 bottom
TR5  40.32,53.02 270 bottom
TR6  40.32,72.07 270 bottom
TR7  40.32,91.12 270 bottom
TR8  40.32,110.17 270 bottom
TRIG1  36.83,53.02 180 top
TRIG2  36.83,72.07 180 top
TRIG3  36.83,91.12 180 top
TRIG4  36.83,110.17 180 top
U1  7.46,12.7 270 bottom
U3  26.04,74.3 180 bottom
U$23  6.35,2.54 0 top
U$26  31.75,2.54 0 top
UPSW1  41.91,7.3 0 top

### Tracks (layer width: path | path; a pad name or v marks a point on that pad's centre or on a via)
+3V3A
  Bottom 0.254: C64.1 23.26,99.94 23.81,100.49 23.81,101.97 DAC.4
  Bottom 0.508: U3.5 25.08,70.72 C38.1 | IC11.8 13.97,61.54 13.97,59.69 C60.1 22.86,59.69 25.16,61.99 C39.1 25.16,70.18 C38.1 | C61.1 14.29,78.82 | IC8.8 14.29,80.65 14.29,78.82 | 14.29,78.82 14.29,77.15 21.59,69.85 24.22,69.85 C38.1 | C64.1 18.66,99.94 17.78,99.06 17.78,91.44 22.22,87 22.22,71.75 22.86,71.12 24.22,71.12 C38.1
+3V3D  (via drill 0.51)
  Top 0.508: TEENSY3.1.3.3V 30.48,20.96 32.38,19.05 v32.38,16.19 | JP2.2 v24.13,13.78 | v29.53,98.74 v29.53,67.95
  Bottom 0.254: DAC.12 24.46,97.48 25.79,98.82 C65.1
  Bottom 0.508: TEENSY3.1.3.3V 30.48,27.67 C9.1 | R1.2 3.49,16.19 2.54,15.24 2.54,12.7 3.73,11.51 U1.3 9.12,11.51 11.4,13.78 R45.2 v24.13,13.78 29.97,13.78 v32.38,16.19 | C9.1 31.11,28.3 | C65.1 28.02,98.74 v29.53,98.74 | C9.1 32.07,27.94 32.7,28.58 32.7,39.05 29.53,42.23 v29.53,67.95
+5V
  Bottom 0.508: 26.67,79.69 29.2,79.69 L2.2 | 26.67,79.69 26.12,79.69 C41.1 25.8,80.01 25.4,80.01 25.4,78.11 25.08,77.79 U3.1 | TEENSY3.1.VIN 35.56,27.67 C66.1 34.61,27.94 33.97,28.58 33.97,40.96 31.75,43.18 31.75,73.66 30,75.41 28.5,75.41 | 26.67,79.69 26.67,78.11 26.98,77.79 U3.3 26.98,75.41 26.99,75.41 28.5,75.41 | C40.1 28.5,75.41
+12V  (via drill 0.51)
  Top 0.508: v25.4,135.89 v25.4,119.38 | C74.+ 46.99,139.7 v46.99,79.06
  Bottom 0.508: v25.4,119.38 IC10.4 C62.1 | C43.1 42.9,76.25 IC7.2 42.96,79.06 v46.99,79.06
  Bottom 1.016: C76.1 40.8,142.24 | 40.8,142.24 C74.+ | 40.8,142.24 40.82,142.22 D9.C 40.64,139.52 40.64,136.02 C78.1 v25.4,135.89
-12V  (via drill 0.51)
  Top 0.508: v22.86,135.89 v22.86,119.38 | v1.27,102.71 1.27,141.45 2.06,142.24 C75.-
  Bottom 0.508: v22.86,119.38 IC10.11 C63.2 | R76.2 7.47,102.6 C57.1 1.38,102.6 v1.27,102.71
  Bottom 1.016: C77.2 7.46,142.24 | 7.46,142.24 C75.- | 7.46,142.24 7.44,142.22 D11.A 7.62,139.52 7.62,136.02 C79.2 v22.86,135.89
CS_DAC  (via drill 0.51)
  Top 0.254: v27.62,96.2 27.62,26.99 26.67,26.04 v26.67,18.73 | v7.62,18.73 TEENSY3.1.10
  Bottom 0.254: DAC.9 26.48,96.2 v27.62,96.2 | v26.67,18.73 v7.62,18.73
CS_OLED
  Top 0.508: JP2.7 11.43,5.08 12.7,6.35 TEENSY3.1.8
  Bottom 0.508: R45.1 TEENSY3.1.8
CV1
  Bottom 0.254: R61.2 4.34,58.1 19.05,58.1 20.32,56.83 20.32,29.21 17.78,26.67 TEENSY3.1.19/A5
CV2  (via drill 0.51)
  Top 0.254: TEENSY3.1.18/A4 15.56,24.13 15.56,40.96 20.64,46.04 v20.64,65.88
  Bottom 0.254: v20.64,65.88 R65.2
CV3  (via drill 0.51)
  Top 0.254: TEENSY3.1.20/A6 20.32,29.21 22.86,31.75 22.86,66.04 20.64,68.26 v20.64,84.77
  Bottom 0.254: R69.2 v20.64,84.77
CV4  (via drill 0.51)
  Top 0.254: v2.54,76.84 2.54,52.23 7.62,47.15 7.62,31.12 12.7,26.04 TEENSY3.1.17/A3
  Bottom 0.254: v2.54,76.84 4.02,76.84 R73.2
CV_A  (via drill 0.51)
  Top 0.254: v39.37,120.33 35.88,120.33 33.02,117.47 33.02,114.46 29.84,111.28 29.84,107.31 28.89,106.36 v20.32,106.36
  Bottom 0.254: v39.37,120.33 R54.1 | DAC.1 20.57,101.98 20.32,102.23 v20.32,106.36
CV_B  (via drill 0.51)
  Top 0.254: v6.35,120.33 6.35,118.11 7.62,116.84 11.27,116.84 16.51,111.6 16.51,106.68 18.41,104.78 v22.54,104.78
  Bottom 0.254: v6.35,120.33 R57.1 | DAC.2 22.5,104.74 v22.54,104.78
CV_C  (via drill 0.51)
  Top 0.254: v39.37,118.43 35.88,118.43 34.29,116.84 34.29,114.14 30.96,110.81 30.96,106.52 29.21,104.78 v25.72,104.78
  Bottom 0.254: R48.1 v39.37,118.43 | v25.72,104.78 25.72,102.02 DAC.7
CV_D  (via drill 0.51)
  Top 0.254: v8.89,118.43 11.11,118.43 17.94,111.6 17.94,109.06 19.05,107.95 v27.94,107.95
  Bottom 0.254: v8.89,118.43 R51.1 | DAC.8 27.69,101.98 27.94,102.23 v27.94,107.95
DC
  Top 0.254: JP2.6 13.97,10.16 14.76,10.95 16.67,10.95 17.78,9.84 TEENSY3.1.6
DOUT  (via drill 0.51)
  Top 0.254: v24.13,90.81 24.13,31.12 21.59,28.58 21.59,17.78 19.05,15.24 JP2.4
  Bottom 0.254: JP2.4 19.05,5.72 18.41,6.35 5.71,6.35 5.08,6.98 TEENSY3.1.11 | v24.13,90.81 24.13,92.71 25.09,93.68 DAC.11
ENC_L1
  Bottom 0.254: SW_L.B 27.03,34.01 25.4,32.39 TEENSY3.1.22/A8
ENC_L2
  Bottom 0.254: SW_L.A 29.29,39.05 26.67,39.05 22.86,35.24 TEENSY3.1.21/A7
ENC_R1
  Top 0.254: TEENSY3.1.15/A1 7.62,26.67 3.93,30.36 SW_R.B
ENC_R2
  Top 0.254: TEENSY3.1.16/A2 10.16,26.67 6.35,30.48 6.35,38.1 5.44,39.01 SW_R.A
GND  (via drill 0.51)
  other vias: 34.29,86.36 8.89,104.14 1.27,93.98 1.27,91.44 1.27,88.9 41.91,1.27 39.37,1.27 44.45,1.27 21.59,138.43 24.13,138.43 26.67,138.43 24.13,142.24 26.67,142.24 21.59,142.24 17.78,102.87
  pour Bottom: 48.26,152.72 0,152.72 0,0 48.26,0
  pour Top: 48.26,0 0,0 0,152.72 48.26,152.72
N$33
  Bottom 0.508: C42.1 39.37,86.36 38.1,85.09 38.1,80.96 35.56,80.96 35.24,81.28 IC7.3 34,82.88 L2.1
N$40
  Bottom 0.254: UPSW1.3 40.96,5.04 | 40.96,5.04 UPSW1.4 | R85.1 40.96,5.04
N$41
  Bottom 0.254: R86.1 38.66,16.8 DOWNSW1.3 DOWNSW1.4
N$42  (via drill 0.51)
  Top 0.254: v4.13,69.53 4.13,66.04 7.78,62.39 7.94,62.23 11.43,58.74 CV1.P$1
  Bottom 0.254: CV1.P$1 CVIN5.1 | R62.1 v4.13,69.53
N$43
  Bottom 0.254: C52.1 6.27,62.87 IC11.2 | C52.1 R63.2 R62.2 R60.1 4.15,63.11 C52.1
N$44
  Bottom 0.254: IC11.1 6.27,61.59 C52.2 6.01,61.38 R60.2 R61.1
N$45
  Bottom 0.254: R66.1 15.34,68.16 CV2.P$1 CVIN6.1
N$46
  Bottom 0.254: C53.1 R66.2 R67.2 R64.1 18.71,64.38 C53.1 | IC11.6 16.59,64.14 C53.1
N$47
  Bottom 0.254: IC11.7 16.59,62.87 C53.2 16.85,62.65 R64.2 R65.1
N$48
  Bottom 0.254: R70.1 15.34,87.21 CV3.P$1 CVIN7.1
N$49
  Bottom 0.254: 16.85,83.4 R68.1 R71.2 R70.2 C54.1 16.85,83.4 | IC8.6 16.64,83.19 16.85,83.4
N$50
  Bottom 0.254: IC8.7 16.59,81.92 C54.2 17.07,81.92 18.52,81.92 R68.2 18.95,81.92 20.42,81.92 R69.1
N$51  (via drill 0.51)
  Top 0.254: v4.13,88.27 4.13,107.95 6.35,110.17 CVIN8.1
  Bottom 0.254: CV4.P$1 CVIN8.1 | R74.1 v4.13,88.27
N$52
  Bottom 0.254: IC8.2 6.27,81.92 C55.1 6.01,82.13 R72.1 R74.2 R75.2
N$53
  Bottom 0.254: IC8.1 6.27,80.65 6.06,80.43 | 6.06,80.43 C55.2 | 6.06,80.43 R72.2 R73.1
N$54
  Bottom 0.254: TR5.1 TRIG1.P$1 35.98,53.87 R77.1
N$55
  Bottom 0.254: TR6.1 TRIG2.P$1 R79.1
N$56
  Bottom 0.254: TR7.1 TRIG3.P$1 35.98,91.97 R81.1
N$57
  Bottom 0.254: D1.C 38,105.41 R83.2 37.68,103.98 R84.2 37.68,102.02 38.1,101.6 T8.B
N$58
  Bottom 0.254: R81.2 R82.2 38,97.79 T7.B 40.81,96.17 D2.C
N$59
  Bottom 0.254: D3.C 38,67.31 R79.2 37.68,66.04 R80.2 37.68,63.92 38.1,63.5 T6.B
N$60
  Bottom 0.254: R78.2 R77.2 38,57.79 D4.C 40.46,59.34 T5.B
N$61
  Bottom 0.254: R83.1 35.98,109.32 TRIG4.P$1 TR8.1
N$62
  Bottom 0.254: IC10.6 29.29,116.84 | 29.29,116.84 C44.1 | 29.29,116.84 R47.1 31.54,117.9 31.75,118.11 35.66,118.11 R48.2
N$63
  Bottom 0.254: IC10.7 29.29,115.57 C44.2 29.6,115.25 31.22,115.25 R46.1
N$64
  Bottom 0.254: IC10.9 18.97,116.84 | 18.97,116.84 C45.1 | 18.97,116.84 R50.1 16.72,117.9 16.51,118.11 12.6,118.11 R51.2
N$65
  Bottom 0.254: R49.1 17.04,115.25 18.66,115.25 C45.2 18.97,115.57 IC10.8
N$66
  Bottom 0.254: IC10.2 29.29,121.92 | 29.29,121.92 C46.1 | 29.29,121.92 R53.1 31.54,120.87 31.75,120.65 35.66,120.65 R54.2
N$67
  Bottom 0.254: IC10.1 29.29,123.19 C46.2 29.6,123.51 31.22,123.51 R52.1
N$68
  Bottom 0.254: IC10.13 18.97,121.92 | 18.97,121.92 C47.1 | 18.97,121.92 R56.1 16.72,120.87 16.51,120.65 12.6,120.65 R57.2
N$69
  Bottom 0.254: R55.1 17.04,123.51 18.41,123.51 | C47.2 18.66,123.51 18.41,123.51 | IC10.14 18.73,123.19 18.41,123.51
N$70
  Bottom 0.254: CV_B1.1 B.P$1 11.43,124.46 12.06,123.83 R55.2 R56.2
N$71
  Bottom 0.203: R49.2 R50.2
  Bottom 0.254: R50.2 1.9,116.84 1.27,117.47 1.27,147.64 1.9,148.27 CV_D1.1 D.P$1
N$72
  Bottom 0.254: CV_A1.1 A.P$1 36.83,124.46 36.2,123.83 R52.2 R53.2
N$73
  Top 0.254: C.P$1 CV_C1.1
  Bottom 0.254: R46.2 R47.2 46.36,116.84 46.99,117.47 46.99,147.32 46.04,148.27 CV_C1.1
N$196
  Bottom 1.016: D11.C 16.51,139.7 18.19,141.38 J2.4 18.19,148.68 J3.4
N$263
  Bottom 1.016: D9.A 31.75,139.7 30.07,141.38 J2.1 30.07,148.68 J3.1
OFFSET  (via drill 0.51)
  Top 0.508: v6.03,97.79 v6.03,88.27 v6.03,69.53
  Bottom 0.254: 10.43,100.45 IC9.2 | R63.1 6.09,67.31 18.57,67.31 18.73,67.47 R67.1 | R71.1 18.73,86.52 18.57,86.36 6.29,86.36 R75.1
  Bottom 0.508: R76.1 7.72,100.65 10.33,100.65 IC9.2 | 10.43,100.45 C56.1 v6.03,97.79 | R75.1 v6.03,88.27 | R63.1 v6.03,69.53
POGO  (via drill 0.89)
  Bottom 0.508: U1.2 8.4,16.1 R1.1 v29.21,16.19
RST
  Top 0.254: JP2.5 16.51,4.45 15.24,5.72 TEENSY3.1.7
RST_DAC  (via drill 0.51)
  Top 0.254: TEENSY3.1.9 10.16,17.78 13.97,21.59 13.97,41.28 18.73,46.04 18.73,85.41 22.22,88.9 v22.22,90.81
  Bottom 0.254: DAC.13 23.8,94.28 22.22,92.71 v22.22,90.81
SCK  (via drill 0.51)
  Top 0.254: v25.72,92.08 25.72,46.99 25.72,30.16 24.13,28.58 v24.13,21.59 24.13,17.15 21.59,14.61 JP2.3
  Bottom 0.254: v25.72,92.08 25.76,92.11 DAC.10 | TEENSY3.1.13 2.54,22.86 3.81,21.59 v24.13,21.59
SW_B
  Bottom 0.254: C58.1 38.76,15 | 38.76,15 R86.2 | TEENSY3.1.4 22.86,10.16 24.13,11.43 38.1,11.43 38.76,12.09 38.76,15
SW_L
  Bottom 0.254: C51.1 43.74,33.93 SW_L.E 43.83,25.42 40,21.59 28.57,21.59 27.94,22.23 TEENSY3.1.23/A9
SW_R
  Bottom 0.254: TEENSY3.1.14/A0 5.08,26.67 6.35,27.94 17.14,27.94 18.43,29.23 SW_R.E
SW_T
  Bottom 0.254: C59.2 42.84,8.15 R85.2 40.64,7.84 38.95,7.84 37.47,6.35 20.95,6.35 20.32,6.98 TEENSY3.1.5
TR1  (via drill 0.51)
  Top 0.254: v44.77,60.64 46.99,58.42 46.99,13.97 44.45,11.43 33.66,11.43 33.02,10.8 TEENSY3.1.0
  Bottom 0.254: T5.C v44.77,60.64
TR2  (via drill 0.51)
  Top 0.254: TEENSY3.1.1 30.48,10.48 32.38,12.38 42.23,12.38 43.18,13.34 43.18,29.21 46.04,32.07 46.04,56.83 43.18,59.69 43.18,63.82 43.81,64.45 v44.77,64.45
  Bottom 0.254: T6.C v44.77,64.45
TR3  (via drill 0.51)
  Top 0.254: TEENSY3.1.2 27.94,10 31.27,13.34 41.27,13.34 41.91,13.97 41.91,31.27 41.91,40.01 45.08,43.18 45.08,55.88 41.91,59.06 41.91,64.77 43.18,66.04 44.77,67.63 v44.77,98.74
  Bottom 0.254: T7.C v44.77,98.74
TR4  (via drill 0.51)
  Top 0.254: TEENSY3.1.3 25.4,10 29.69,14.29 39.69,14.29 40.64,15.24 40.64,40.64 44.13,44.13 44.13,54.93 40.96,58.1 40.96,65.72 43.81,68.58 43.81,97.16 43.18,97.79 43.18,99.7 44.77,101.28 v44.77,102.55
  Bottom 0.254: v44.77,102.55 T8.C
V_BIAS
  Bottom 0.254: C50.1 27.91,111.97 R59.2 R58.1 24.13,118.11 | IC10.10 24.13,118.11 | 24.13,118.11 IC10.5 | IC10.12 24.13,120.65 | 24.13,120.65 IC10.3 | 24.13,118.11 24.13,120.65
VREF_2V5
  Bottom 0.254: C48.1 C49.1 24.11,110.25 | 24.11,110.25 R58.2 | DAC.3 23.16,103.18 24.13,104.14 24.13,110.22 24.11,110.25

### Text on the board
tNames: CS | DC | Rst | D1 | D0 | 3v3 | Gnd
bNames: LWOC / 2v1 / sep 2022 / dk / hale | with thanks: / e gillet / m stadler / p dowling / t churches / you | POGO | pogo pin: 0.85mm
guidelines: D | C | B | A | out | 4 | 3 | 2 | 1 | trig | in | OC | LW